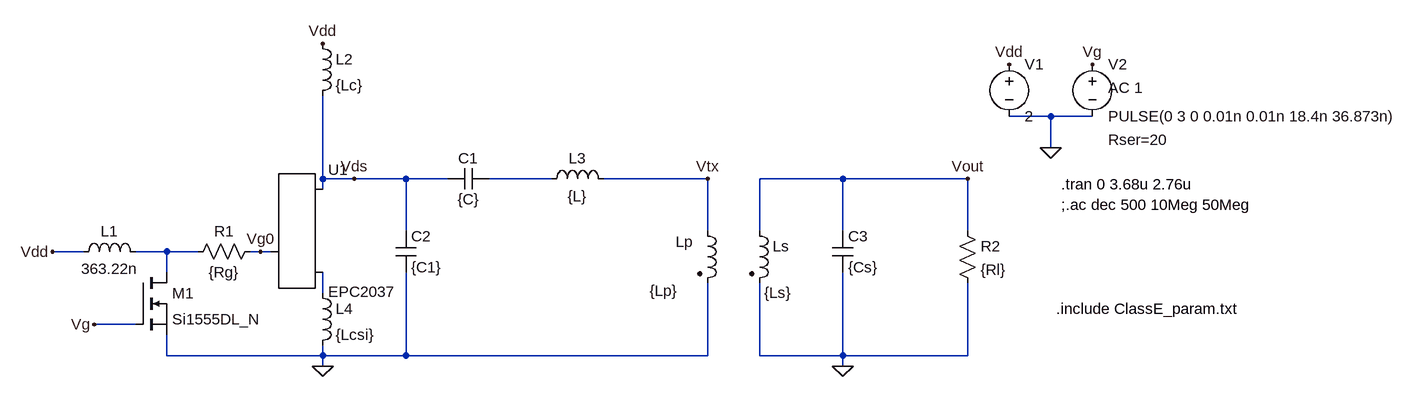
[diagram p0: schematic Draft1.asc]
Draft1.asc, the LTspice schematic file:
Version 4
SHEET 1 1448 680
WIRE 720 -336 656 -336
WIRE 784 -336 720 -336
WIRE 720 -288 720 -336
WIRE -400 -240 -400 -368
WIRE -352 -240 -400 -240
WIRE -272 -240 -352 -240
WIRE -208 -240 -272 -240
WIRE -48 -240 -144 -240
WIRE 192 -240 32 -240
WIRE 400 -240 272 -240
WIRE 592 -240 400 -240
WIRE -400 -224 -400 -240
WIRE -272 -160 -272 -240
WIRE 192 -160 192 -240
WIRE 272 -160 272 -240
WIRE 400 -160 400 -240
WIRE 592 -160 592 -240
WIRE -768 -128 -816 -128
WIRE -640 -128 -688 -128
WIRE -592 -128 -640 -128
WIRE -496 -128 -512 -128
WIRE -480 -128 -496 -128
WIRE -640 -96 -640 -128
WIRE -400 -64 -400 -96
WIRE -688 -16 -752 -16
WIRE -640 32 -640 0
WIRE -400 32 -400 16
WIRE -400 32 -640 32
WIRE -272 32 -272 -96
WIRE -272 32 -400 32
WIRE 192 32 192 -80
WIRE 192 32 -272 32
WIRE 272 32 272 -80
WIRE 400 32 400 -96
WIRE 400 32 272 32
WIRE 592 32 592 -80
WIRE 592 32 400 32
WIRE -400 48 -400 32
WIRE 400 48 400 32
FLAG -816 -128 Vdd
FLAG -752 -16 Vg
FLAG 720 -288 0
FLAG 656 -416 Vdd
FLAG 784 -416 Vg
FLAG -400 -448 Vdd
FLAG 192 -240 Vtx
FLAG -400 48 0
FLAG 400 48 0
FLAG 592 -240 Vout
FLAG -352 -240 Vds
FLAG -496 -128 Vg0
SYMBOL res -496 -144 R90
WINDOW 0 0 56 VBottom 2
WINDOW 3 32 56 VTop 2
SYMATTR InstName R1
SYMATTR Value {Rg}
SYMBOL ind -784 -112 R270
WINDOW 0 32 56 VTop 2
WINDOW 3 5 56 VBottom 2
SYMATTR InstName L1
SYMATTR Value 363.22n
SYMBOL voltage 656 -432 R0
WINDOW 123 0 0 Left 0
WINDOW 39 0 0 Left 0
SYMATTR InstName V1
SYMATTR Value 2
SYMBOL voltage 784 -432 R0
WINDOW 123 24 52 Left 2
WINDOW 39 24 132 Left 2
SYMATTR Value2 AC 1
SYMATTR SpiceLine Rser=20
SYMATTR InstName V2
SYMATTR Value PULSE(0 3 0 0.01n 0.01n 18.4n 36.873n)
SYMBOL EPCGaN -480 -128 R0
SYMATTR InstName U1
SYMATTR Value EPC2037
SYMBOL ind -416 -464 R0
SYMATTR InstName L2
SYMATTR Value {Lc}
SYMATTR SpiceLine Rser=0.1
SYMBOL ind -64 -224 R270
WINDOW 0 32 56 VTop 2
WINDOW 3 5 56 VBottom 2
SYMATTR InstName L3
SYMATTR Value {L}
SYMATTR SpiceLine Rser=0.1
SYMBOL cap -144 -256 R90
WINDOW 0 0 32 VBottom 2
WINDOW 3 32 32 VTop 2
SYMATTR InstName C1
SYMATTR Value {C}
SYMATTR SpiceLine Rser=0.1
SYMBOL res 576 -176 R0
SYMATTR InstName R2
SYMATTR Value {Rl}
SYMBOL cap -288 -160 R0
SYMATTR InstName C2
SYMATTR Value {C1}
SYMATTR SpiceLine Rser=0.1
SYMBOL ind2 176 -176 R0
WINDOW 0 -33 33 Left 2
WINDOW 3 -73 108 Left 2
SYMATTR InstName Lp
SYMATTR Value {Lp}
SYMATTR Type ind
SYMATTR SpiceLine Rser={Rp} Cpar={Cpp}
SYMBOL ind2 256 -176 R0
WINDOW 3 23 111 Left 2
SYMATTR Value {Ls}
SYMATTR InstName Ls
SYMATTR Type ind
SYMATTR SpiceLine Rser={Rs} Cpar={Cps}
SYMBOL cap 384 -160 R0
SYMATTR InstName C3
SYMATTR Value {Cs}
SYMBOL ind -416 -80 R0
SYMATTR InstName L4
SYMATTR Value {Lcsi}
SYMATTR SpiceLine Rser=0.1
SYMBOL nmos -688 -96 R0
SYMATTR InstName M1
SYMATTR Value Si1555DL_N
TEXT 728 -40 Left 2 !.include ClassE_param.txt
TEXT 736 -232 Left 2 !.tran 0 3.68u 2.76u
TEXT 736 -200 Left 2 !;.ac dec 500 10Meg 50Meg

The netlist it stands for:
* Draft1.asc
R1 Vg0 N002 {Rg}
L1 Vdd N002 363.22n
V1 Vdd 0 2
V2 Vg 0 PULSE(0 3 0 0.01n 0.01n 18.4n 36.873n) AC 1 Rser=20
XU1 Vg0 Vds N003 EPC2037
L2 Vdd Vds {Lc} Rser=0.1
L3 N001 Vtx {L} Rser=0.1
C1 N001 Vds {C} Rser=0.1
R2 Vout 0 {Rl}
C2 Vds 0 {C1} Rser=0.1
Lp Vtx 0 {Lp} Rser={Rp} Cpar={Cpp}
Ls Vout 0 {Ls} Rser={Rs} Cpar={Cps}
C3 Vout 0 {Cs}
L4 N003 0 {Lcsi} Rser=0.1
M1 N002 Vg 0 0 Si1555DL_N
.model NMOS NMOS
.model PMOS PMOS
.lib standard.mos
.include ClassE_param.txt
.tran 0 3.68u 2.76u
;.ac dec 500 10Meg 50Meg
.backanno
.end